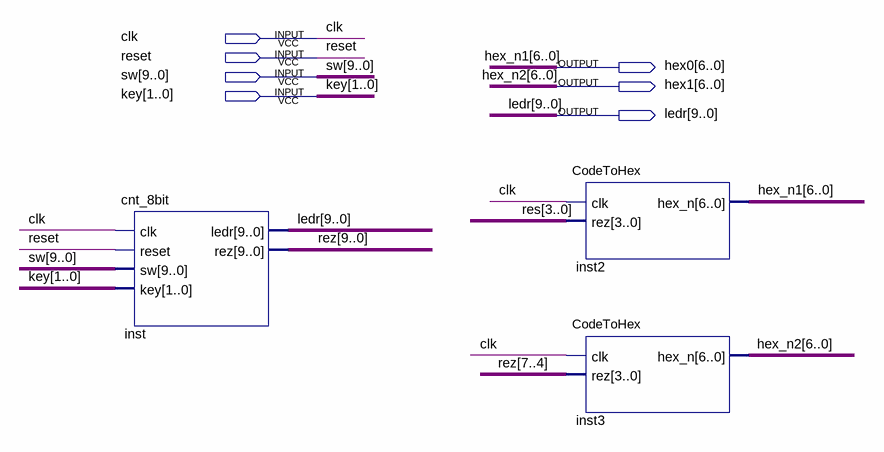
[diagram p0: schematic sheet]
// Quartus schematic Block1.bdf as structural Verilog: 3 symbols, 7 pins
module Block1 (
  input  clk,
  input  reset,
  input  [9:0] sw,
  input  [1:0] key,
  output [6:0] hex0,
  output [6:0] hex1,
  output [9:0] ledr
);

  wire [3:0] res;
  wire [9:0] rez;

  cnt_8bit inst (.clk(clk), .reset(reset), .sw(sw), .key(key), .ledr(ledr), .rez(rez));
  CodeToHex inst2 (.clk(clk), .rez(res), .hex_n(hex0));
  CodeToHex inst3 (.clk(clk), .rez(rez[7:4]), .hex_n(hex1));

  // Other names for the same wires on the sheet: hex_n1[6:0] = hex0; hex_n2[6:0] = hex1
endmodule
